# EAGLE design Buffered mult rev 3 (EAGLE 7.5.0)
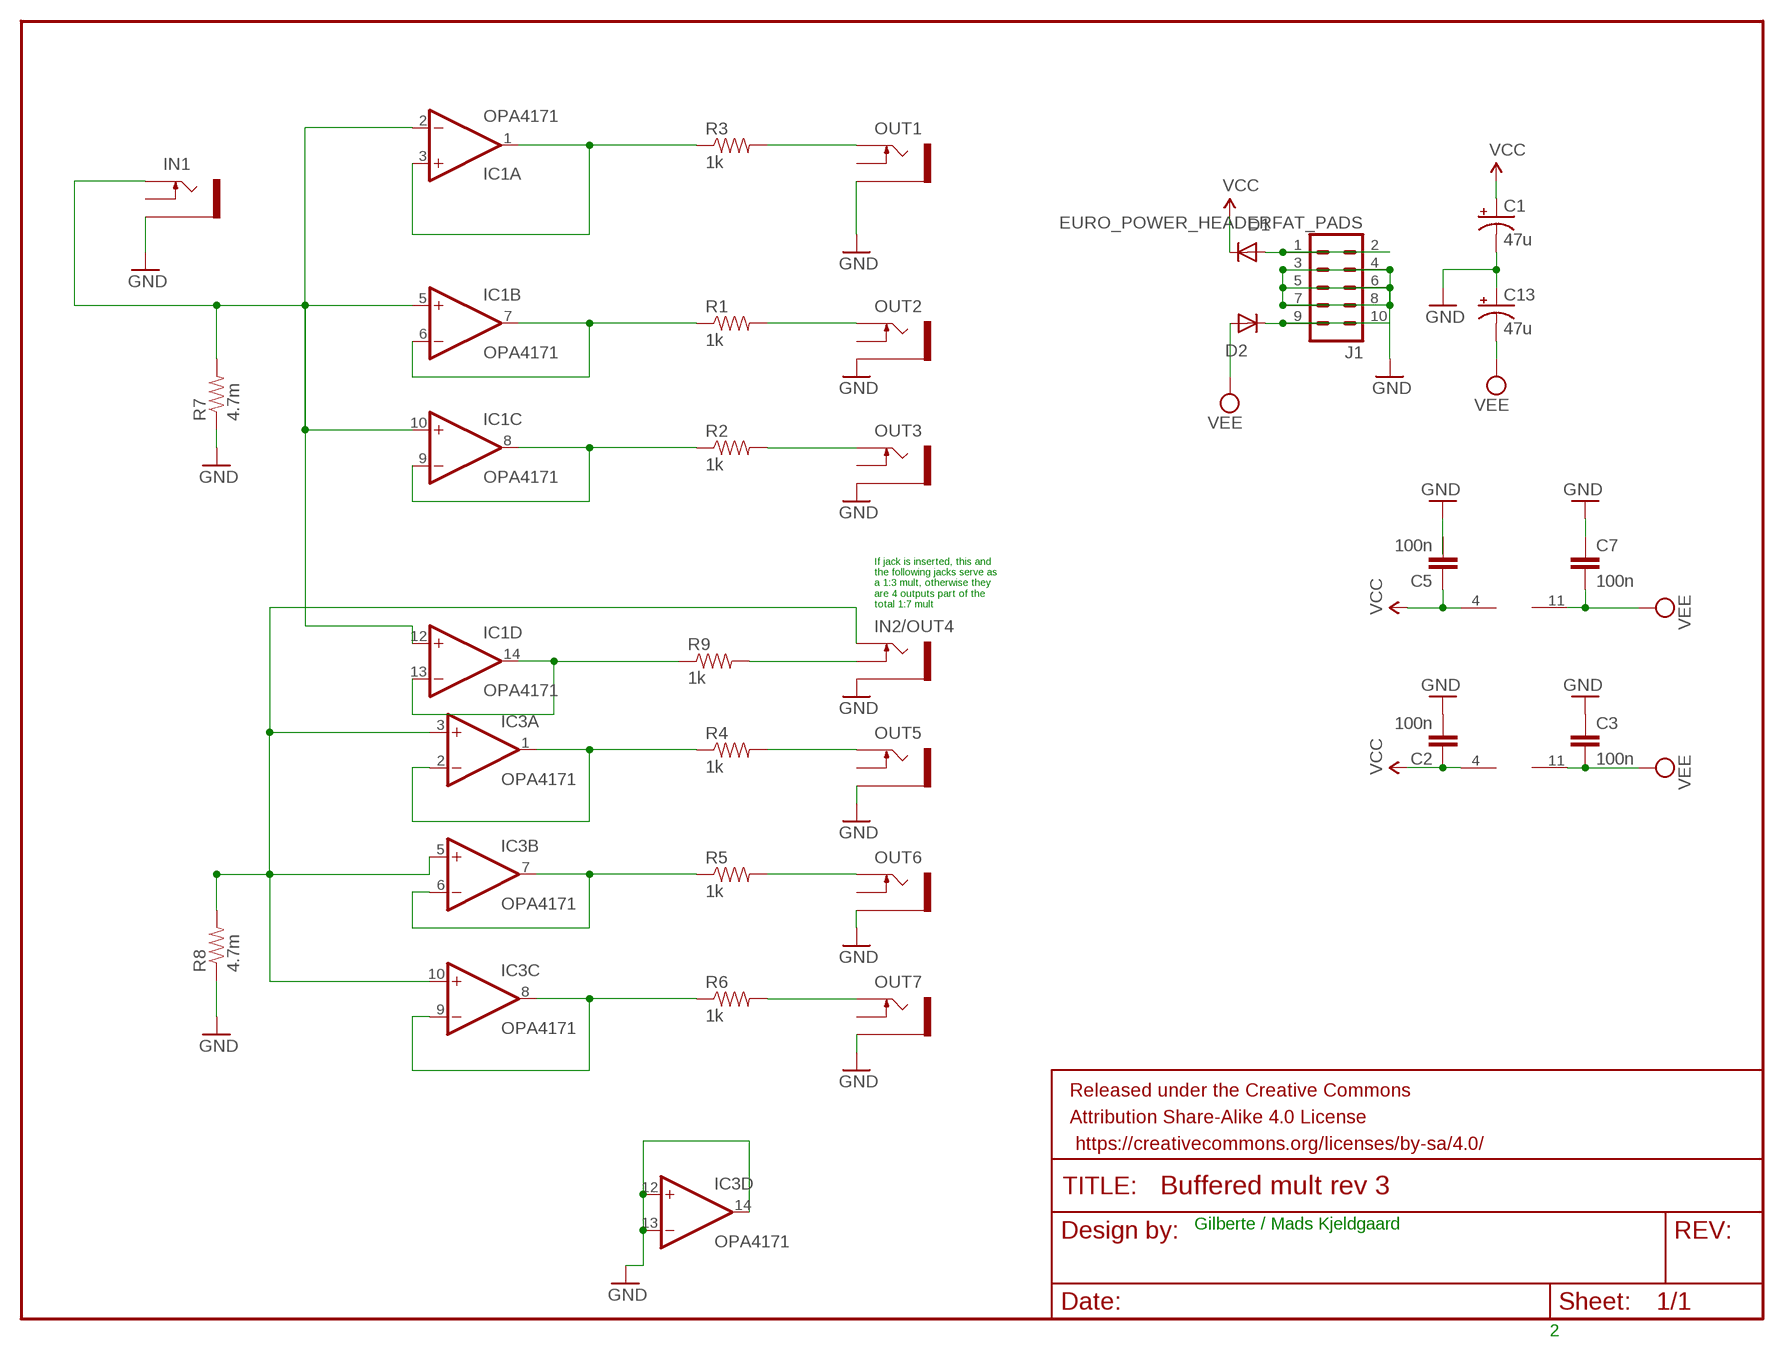
[diagram p0: schematic, sheet 1]

## Parts
C1  47u  CPOL-USD  [PANASONIC_D]
C2  100n  CAP1206  [1206]
C3  100n  CAP1206  [1206]
C5  100n  CAP1206  [1206]
C7  100n  CAP1206  [1206]
C13  47u  CPOL-USD  [PANASONIC_D]
D1  1N5819HW  DIODE-SOD123  [SOD123]
D2  1N5819HW  DIODE-SOD123  [SOD123]
FRAME1  FRAME-LETTER  [CREATIVE_COMMONS]
IC1  OPA4171  TL074PW  [TSSOP14]
IC3  OPA4171  TL074PW  [TSSOP14]
IN1  PJ302M  [PJ302M]
IN2/OUT4  PJ302M  [PJ302M]
J1  EURO_POWER_HEADERFAT_PADS  [EURO_PWR_HEADER_FAT]
OUT1  PJ302M  [PJ302M]
OUT2  PJ302M  [PJ302M]
OUT3  PJ302M  [PJ302M]
OUT5  PJ302M  [PJ302M]
OUT6  PJ302M  [PJ302M]
OUT7  PJ302M  [PJ302M]
R1  1k  RESISTOR1206  [1206]
R2  1k  RESISTOR1206  [1206]
R3  1k  RESISTOR1206  [1206]
R4  1k  RESISTOR1206  [1206]
R5  1k  RESISTOR1206  [1206]
R6  1k  RESISTOR1206  [1206]
R7  4.7m  RESISTOR1206  [1206]
R8  4.7m  RESISTOR1206  [1206]
R9  1k  RESISTOR1206  [1206]

## Nets
GND: C1.- C2.2 C3.1 C5.2 C7.1 C13.+ IC3.12(D:+IN) IC3.13(D:-IN) IC3.14(D:OUT) IN1.GND(SLEEVE) IN2/OUT4.GND(SLEEVE) J1.3 J1.4 J1.5 J1.6 J1.7 J1.8 OUT1.GND(SLEEVE) OUT2.GND(SLEEVE) OUT3.GND(SLEEVE) OUT5.GND(SLEEVE) OUT6.GND(SLEEVE) OUT7.GND(SLEEVE) R7.1 R8.1
N$1: OUT7.TIP R6.2
N$2: IC1.1(A:OUT) IC1.3(A:+IN) R3.1
N$3: OUT6.TIP R5.2
N$4: OUT5.TIP R4.2
N$5: IC1.2(A:-IN) IC1.5(B:+IN) IC1.10(C:+IN) IC1.12(D:+IN) IN1.TIP R7.2
N$6: IC1.8(C:OUT) IC1.9(C:-IN) R2.1
N$7: OUT2.TIP R1.2
N$8: OUT3.TIP R2.2
N$9: OUT1.TIP R3.2
N$10: IC1.6(B:-IN) IC1.7(B:OUT) R1.1
N$12: IC3.8(C:OUT) IC3.9(C:-IN) R6.1
N$13: IC3.6(B:-IN) IC3.7(B:OUT) R5.1
N$14: D2.C J1.9 J1.10
N$15: D1.A J1.1 J1.2
N$16: IC1.13(D:-IN) IC1.14(D:OUT) R9.1
N$17: IC3.1(A:OUT) IC3.2(A:-IN) R4.1
N$18: IN2/OUT4.SW(SWITCH) R9.2
N$19: IC3.3(A:+IN) IC3.5(B:+IN) IC3.10(C:+IN) IN2/OUT4.TIP R8.2
VCC: C1.+ C2.1 C5.1 D1.C IC1.4(P:V+) IC3.4(P:V+)
VEE: C3.2 C7.2 C13.- D2.A IC1.11(P:V-) IC3.11(P:V-)
Unconnected: IN1.SW(SWITCH) OUT1.SW(SWITCH) OUT2.SW(SWITCH) OUT3.SW(SWITCH) OUT5.SW(SWITCH) OUT6.SW(SWITCH) OUT7.SW(SWITCH)

## Notes on the sheet
- If jack is inserted, this and 
  the following jacks serve as 
  a 1:3 mult, otherwise they 
  are 4 outputs part of the 
  total 1:7 mult
- Gilberte / Mads Kjeldgaard
- 2

## Library data of the parts
C1 C13 = rcl:CPOL-US: POLARIZED CAPACITOR, American symbol
C2 C3 C5 C7 = SparkFun-Capacitors:CAP: Capacitor Standard 0603 ceramic capacitor, and 0.1" leaded capacitor.
D1 D2 = diode:DIODE-: DIODE
FRAME1 = SparkFun-Aesthetics:FRAME-LETTER: Schematic Frame Standard 8.5x11 US Letter frame
IC1 IC3 = linear:TL074: OP AMP
IN1 IN2/OUT4 OUT1-OUT3 OUT5-OUT7 = pj302m:PJ302M: PJ302M horizontal / right angled mount 3.5 mm jack socket
J1 = MusicThingModular:EURO_POWER_HEADER: Power Header 10 pin power header for Eurorack Power Supplies Variants with fatter pads for easier soldering, and the LOCK variant which has 5mil offset pins to hold the component in place before soldering
R1-R9 = SparkFun-Passives:RESISTOR: Resistor Basic schematic elements and footprints for 0603, 1206, and PTH resistors.

## Board
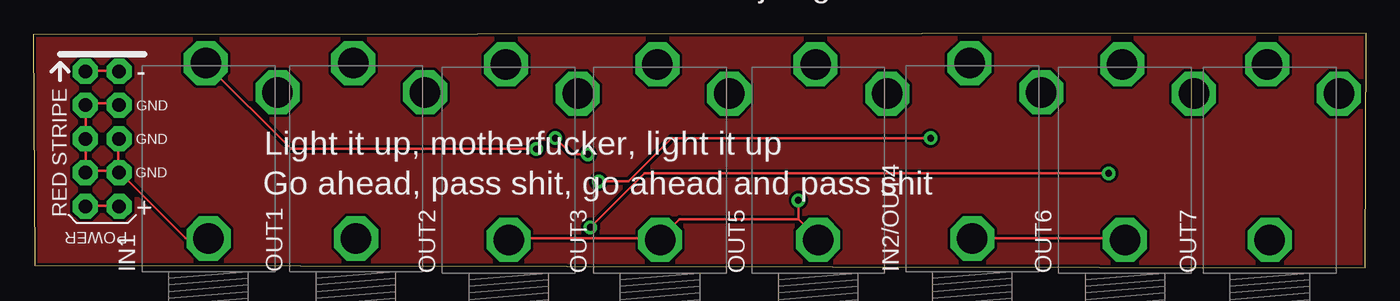
[diagram p1: board, top side]
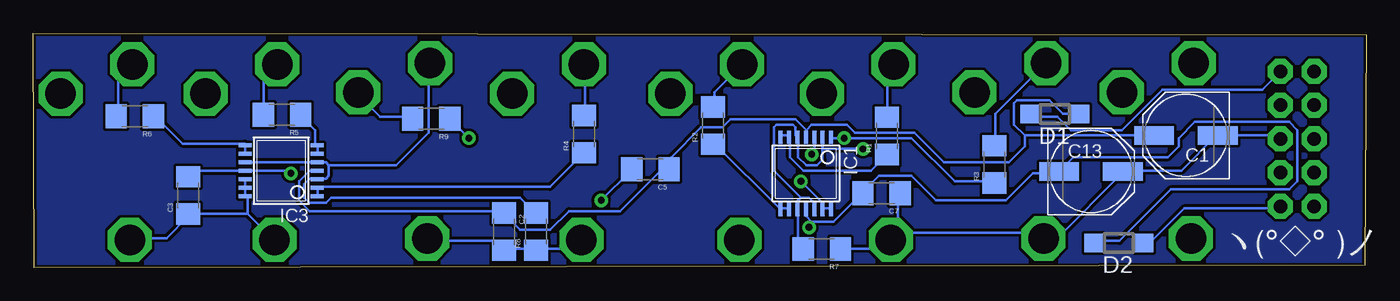
[diagram p2: board, bottom side, seen from below]

Size 100.37 x 17.65 mm. Coordinates in mm from the lower left corner, seen from the top.
Outline: 100.3,0 100.37,17.65 0,17.55 0.1,0.2 100.3,0
Copper layers (1*16): Top 0.035mm / dielectric 1.5mm / Bottom 0.035mm
Design rules "SparkFun": minimum track width 8mil, minimum drill 20mil, track to track 8mil, track to pad 8mil, pad to pad 8mil, via to via 8mil, smd to smd 8mil, copper to edge 8mil, drill to drill 8mil, minimum pad ring 12mil, minimum via ring 10mil, stop-mask expansion 4mil, vias tented up to drill 20mil, thermal gap 10mil

### Footprints (pad centres in the part's own frame; a part is rotated, then mirrored left to right if it is on the bottom)
PANASONIC_D = smd 3 x 1.4: + 2.4,0; - -2.4,0
1206 = smd 1.6 x 1.8: 1 -1.4,0; 2 1.4,0
SOD123 = smd 1.4 x 1.4: A 1.9,0; C -1.9,0
TSSOP14 = smd 0.305 x 0.991: 1 -1.905,-2.718; 2 -1.27,-2.718; 3 -0.635,-2.718; 4 0,-2.718; 5 0.635,-2.718; 6 1.27,-2.718; 7 1.905,-2.718; 8 1.905,2.718; 9 1.27,2.718; 10 0.635,2.718; 11 0,2.718; 12 -0.635,2.718; 13 -1.27,2.718; 14 -1.905,2.718
PJ302M = drill 2.3 pad 3.3 octagon: GND 2.5,0; SW 13.5,-5.2; TIP 15.7,0.2
EURO_PWR_HEADER_FAT = drill 1.016 pad 1.88 octagon: 1 -5.08,-1.27; 2 -5.08,1.27; 3 -2.54,-1.27; 4 -2.54,1.27; 5 0,-1.27; 6 0,1.27; 7 2.54,-1.27; 8 2.54,1.27; 9 5.08,-1.27; 10 5.08,1.27

### Placement (x,y rotation side)
C1  13.58,9.96 180 bottom
C2  64.93,2.71 270 bottom
C3  88.69,5.44 90 bottom
C5  53.9,7.4 180 bottom
C7  36.5,5.6 180 bottom
C13  20.73,7.24 0 bottom
D1  23.44,11.56 180 bottom
D2  18.64,1.86 180 bottom
FRAME1  4.2,20.7 0 top  (outside the outline)
IC1  42.2,7.1 180 bottom
IC3  81.7,7.3 90 bottom
IN1  13.2,-0.3 90 top
IN2/OUT4  70.7,-0.3 90 top
J1  5.2,9.7 270 top
OUT1  24.3,-0.3 90 top
OUT2  35.8,-0.4 90 top
OUT3  47.2,-0.4 90 top
OUT5  59.1,-0.4 90 top
OUT6  82.2,-0.4 90 top
OUT7  93.1,-0.4 90 top
R1  36.09,9.92 90 bottom
R2  49.19,10.7 90 bottom
R3  27.99,7.78 90 bottom
R4  58.89,10.06 90 bottom
R5  81.64,11.51 180 bottom
R6  92.72,11.41 180 bottom
R7  41,1.41 180 bottom
R8  62.51,2.72 90 bottom
R9  70.4,11.2 180 bottom

### Tracks (layer width: path | path; a pad name or v marks a point on that pad's centre or on a via)
GND  (via drill 0.51)
  Top 0.203: 57.61,3.65 v57.61,5.08 | 57.61,3.65 59.03,2.23 OUT5.GND | OUT6.GND 82.19,2.23 70.81,2.23 IN2/OUT4.GND | OUT2.GND 35.86,2.23 47.04,2.23 OUT3.GND 47.24,2.23 48.66,3.65 57.61,3.65 | J1.4 6.4,12.39 3.96,12.39 J1.3 3.96,12.19 3.96,9.75 J1.5 3.96,9.55 3.96,7.31 | 6.4,7.31 6.4,9.55 J1.6 | 6.4,7.31 3.96,7.31 | 3.96,7.31 J1.7 | 6.4,7.31 J1.8 6.6,7.11 11.48,2.23 13.11,2.23 IN1.GND
  Bottom 0.203: IC3.12 84.43,6.7 84.43,6.09 IC3.13 84.43,5.89 84.43,5.48 IC3.14 84.22,5.28 84.22,4.06 | 84.22,4.06 82.4,2.23 OUT6.GND | 84.22,4.06 88.49,4.06 C3.1 88.69,3.86 90.32,2.23 92.96,2.23 OUT7.GND | v57.61,5.08 55.37,7.31 C5.2 | OUT5.GND 59.23,2.03 59.84,1.42 62.48,1.42 R8.1 62.69,1.42 64.92,1.42 C2.2 65.12,1.42 65.73,2.03 70.61,2.03 IN2/OUT4.GND | 35.25,2.64 35.25,5.48 C7.1 | 35.25,2.64 35.66,2.23 OUT2.GND | R7.1 39.52,1.42 36.47,1.42 35.86,2.03 OUT2.GND | J1.6 6.6,9.75 6.81,9.95 11.07,9.95 C1.- 11.28,9.95 13.92,7.31 18.19,7.31 C13.+ 18.39,7.11 23.27,2.23 24.28,2.23 OUT1.GND 24.48,2.23 24.89,2.64 35.25,2.64 | 35.25,2.64 OUT2.GND
N$1
  Bottom 0.203: R6.2 93.98,11.58 93.98,14.22 92.96,15.24 OUT7.TIP
N$2  (via drill 0.51)
  Top 0.203: v41.76,8.53 40.54,8.53 v39.32,9.75
  Bottom 0.203: IC1.1 40.33,9.75 v39.32,9.75 34.24,9.75 30.99,6.5 28.14,6.5 R3.1 | v41.76,8.53 41.55,8.73 41.55,9.75 IC1.3
N$3
  Bottom 0.203: R5.2 83.01,11.58 83.01,14.42 82.19,15.24 OUT6.TIP
N$4
  Bottom 0.203: R4.2 58.83,11.58 58.83,15.24 OUT5.TIP
N$5  (via drill 0.51)
  Top 0.203: v37.9,8.94 19.4,8.94 13.11,15.24 IN1.TIP
  Bottom 0.203: 40.94,8.94 40.94,8.12 41.35,7.72 42.16,7.72 42.77,8.33 42.77,9.75 IC1.5 42.98,9.95 42.98,10.56 43.18,10.77 44.4,10.77 44.6,10.56 44.6,7.31 42.57,5.28 | 40.94,8.94 40.94,9.75 IC1.2 | 42.57,5.28 41.96,5.28 41.55,4.87 41.55,4.47 IC1.12 | 42.57,5.28 42.77,5.08 42.77,4.47 IC1.10 42.77,4.26 42.77,1.62 42.57,1.42 R7.2 | v37.9,8.94 40.94,8.94
N$6
  Bottom 0.203: IC1.9 43.59,4.47 43.99,4.47 IC1.8 44.19,4.47 49.07,9.34 R2.1
N$7
  Bottom 0.203: R1.2 36.07,11.38 36.07,14.83 35.66,15.24 OUT2.TIP
N$8
  Bottom 0.203: R2.2 49.07,12.19 49.07,13.21 47.04,15.24 OUT3.TIP
N$9
  Bottom 0.203: R3.2 27.94,9.34 27.94,11.58 24.28,15.24 OUT1.TIP
N$10
  Bottom 0.203: IC1.7 43.99,9.95 43.59,9.95 IC1.6 43.38,9.75 43.38,8.33 42.37,7.31 37.29,7.31 36.27,8.33 R1.1
N$11
  pour Bottom (isolate 0.012): 0.1,17.7 100.2,17.5 100.2,0.1 0.1,0.1
N$12
  Bottom 0.203: IC3.9 84.43,8.53 84.43,9.14 IC3.8 84.43,9.34 89.1,9.34 91.13,11.38 R6.1
N$13
  Bottom 0.203: IC3.6 78.94,8.53 78.94,9.14 IC3.7 79.14,9.34 79.14,10.36 80.16,11.38 R5.1
N$14
  Top 0.203: J1.9 3.96,4.67 6.4,4.67 J1.10
  Bottom 0.203: D2.C 16.56,2.03 16.15,2.03 13.71,4.47 6.6,4.47 J1.10
N$15
  Top 0.203: J1.1 3.96,14.83 6.4,14.83 J1.2
  Bottom 0.203: D1.A 25.3,11.38 23.27,11.38 22.25,10.36 18.39,10.36 15.34,13.41 7.82,13.41 6.6,14.63 J1.2
N$16  (via drill 0.51)
  Top 0.203: v42.57,6.5 44.8,6.5 48.05,9.75 v67.56,9.75
  Bottom 0.203: 40.94,4.47 40.33,4.47 IC1.14 | 40.94,4.47 40.94,4.87 v42.57,6.5 | v67.56,9.75 68.98,11.17 R9.1 | 40.94,4.47 IC1.13
N$17
  Bottom 0.203: IC3.1 78.94,5.48 78.94,5.89 IC3.2 78.94,6.09 61.47,6.09 59.03,8.53 R4.1
N$18
  Bottom 0.203: R9.2 71.83,11.38 74.27,11.38 75.89,13 IN2/OUT4.SW
N$19
  Bottom 0.203: 78.13,7.72 78.13,6.91 78.33,6.7 78.94,6.7 IC3.3 79.14,6.7 79.55,6.7 79.96,6.3 79.96,5.28 79.55,4.87 78.33,4.87 77.93,5.28 63.7,5.28 62.69,4.26 R8.2 | 78.13,7.72 78.33,7.92 78.94,7.92 IC3.5 79.14,7.92 84.22,7.92 IC3.10 | 78.13,7.72 73.05,7.72 70.61,10.16 70.61,15.24 IN2/OUT4.TIP
N$20
  pour Top (isolate 0.012): 0.2,17.5 100.2,17.4 100.2,0 0.2,0.3
VCC
  Bottom 0.203: 25.7,9.95 26.52,10.77 26.52,12.39 26.31,12.59 23.87,12.59 22.86,11.58 21.64,11.58 D1.C | 25.7,9.95 16.15,9.95 C1.+ | 42.16,10.36 42.16,9.95 IC1.4 | 42.16,10.36 42.98,11.17 47.85,11.17 48.46,10.56 50.09,10.56 52.32,8.33 52.32,7.52 C5.1 52.53,7.31 53.13,7.31 56.18,4.26 60.04,4.26 61.47,2.84 63.7,2.84 64.92,4.06 C2.1 65.12,4.26 79.55,4.26 80.36,5.08 80.36,6.5 79.55,7.31 79.14,7.31 IC3.4 | 25.7,9.95 25.7,9.14 26.92,7.92 31.8,7.92 34.03,10.16 38.51,10.16 39.11,10.77 41.76,10.77 42.16,10.36
VEE  (via drill 0.51)
  Top 0.203: v80.97,7.11 46.02,7.11 v41.96,3.05
  Bottom 0.203: D2.A 20.42,2.03 18.59,2.03 14.73,5.89 5.79,5.89 5.18,6.5 5.18,10.36 5.79,10.97 12.9,10.97 14.12,9.75 14.12,9.14 14.93,8.33 22.05,8.33 23.06,7.31 C13.- 23.27,7.11 25.09,7.11 27.13,5.08 32.41,5.08 34.24,6.91 36.68,6.91 37.9,5.69 C7.2 38.1,5.48 40.13,3.45 41.55,3.45 | C3.2 88.49,6.91 88.09,7.31 84.43,7.31 IC3.11 84.22,7.31 81.18,7.31 v80.97,7.11 | 41.55,3.45 41.76,3.45 42.16,3.86 42.16,4.26 IC1.11 | 41.55,3.45 v41.96,3.05

### Text on the board
tNames: Gilberte / Mads Kjeldgaard | Light it up, motherfucker, light it up | Go ahead, pass shit, go ahead and pass shit
bNames: ༼ ͒ ͓ ͒༽ | ༼ ͒ ̶ ͒༽ | ༼ ͒ ̶ ͒༽ | ༼ ͒ ̶ ͒༽ | ヽ(°◇° )ノ | ༼ ͒ ͓ ͒༽